# EAGLE design 9axis_Breakout (EAGLE 9.7.0)
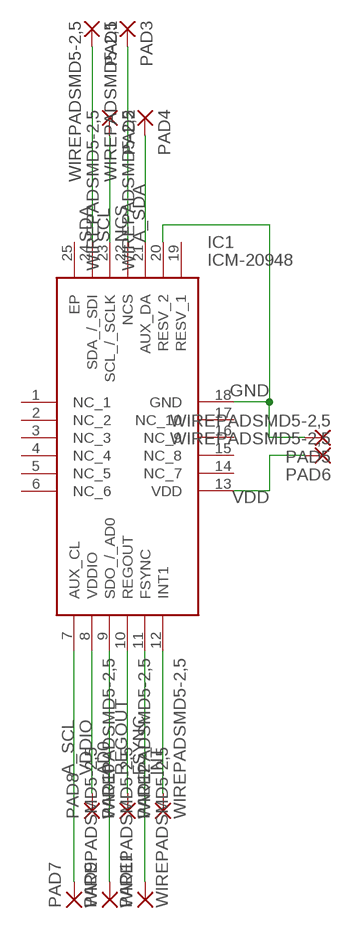
[diagram p0: schematic, sheet 1]

## Parts
IC1  ICM-20948  [QFN40P300X300X105-25N]
PAD1  WIREPADSMD5-2,5  [5-2,5]
PAD2  WIREPADSMD5-2,5  [5-2,5]
PAD3  WIREPADSMD5-2,5  [5-2,5]
PAD4  WIREPADSMD5-2,5  [5-2,5]
PAD5  WIREPADSMD5-2,5  [5-2,5]
PAD6  WIREPADSMD5-2,5  [5-2,5]
PAD7  WIREPADSMD5-2,5  [5-2,5]
PAD8  WIREPADSMD5-2,5  [5-2,5]
PAD9  WIREPADSMD5-2,5  [5-2,5]
PAD10  WIREPADSMD5-2,5  [5-2,5]
PAD11  WIREPADSMD5-2,5  [5-2,5]
PAD12  WIREPADSMD5-2,5  [5-2,5]

## Nets
A_SCL: IC1.7(AUX_CL) PAD7.1(P)
A_SDA: IC1.21(AUX_DA) PAD4.1(P)
AD0: IC1.9(SDO_/_AD0) PAD9.1(P)
FSYNC: IC1.11(FSYNC) PAD11.1(P)
GND: IC1.18(GND) IC1.20(RESV_2) PAD5.1(P)
INT: IC1.12(INT1) PAD12.1(P)
NCS: IC1.22(NCS) PAD3.1(P)
REGOUT: IC1.10(REGOUT) PAD10.1(P)
SCL: IC1.23(SCL_/_SCLK) PAD2.1(P)
SDA: IC1.24(SDA_/_SDI) PAD1.1(P)
VDD: IC1.13(VDD) PAD6.1(P)
VDDIO: IC1.8(VDDIO) PAD8.1(P)
Unconnected: IC1.1(NC_1) IC1.2(NC_2) IC1.3(NC_3) IC1.4(NC_4) IC1.5(NC_5) IC1.6(NC_6) IC1.14(NC_7) IC1.15(NC_8) IC1.16(NC_9) IC1.17(NC_10) IC1.19(RESV_1) IC1.25(EP)

## Library data of the parts
IC1 = ICM-20948:ICM-20948: IMUs - Inertial Measurement Units World's Lowest Power 9-Axis MEMS MotionTracking Device Source: Datasheet <https://product.tdk.com/system/files/dam/doc/product/sensor/mortion-inertial/imu/data_sheet/ds-000189-icm-20948-v1.3.pdf>; ARROW_PART_NUMBER: ICM-20948; ARROW_PRICE-STOCK: https://www.arrow.com/en/products/icm-20948/invensense?region=nac; DESCRIPTION: IMUs - Inertial Measurement Units World's Lowest Power 9-Axis MEMS MotionTracking Device; HEIGHT: 1.05mm; MANUFACTURER_NAME: TDK; MANUFACTURER_PART_NUMBER: ICM-20948; MOUSER_PART_NUMBER: 410-ICM-20948; MOUSER_PRICE-STOCK: https://www.mouser.co.uk/ProductDetail/TDK-InvenSense/ICM-20948?qs=u4fy%2FsgLU9OtGc31yF%2Friw%3D%3D
PAD1-PAD12 = wirepad:WIREPAD: Wire PAD connect wire on PCB

## Board
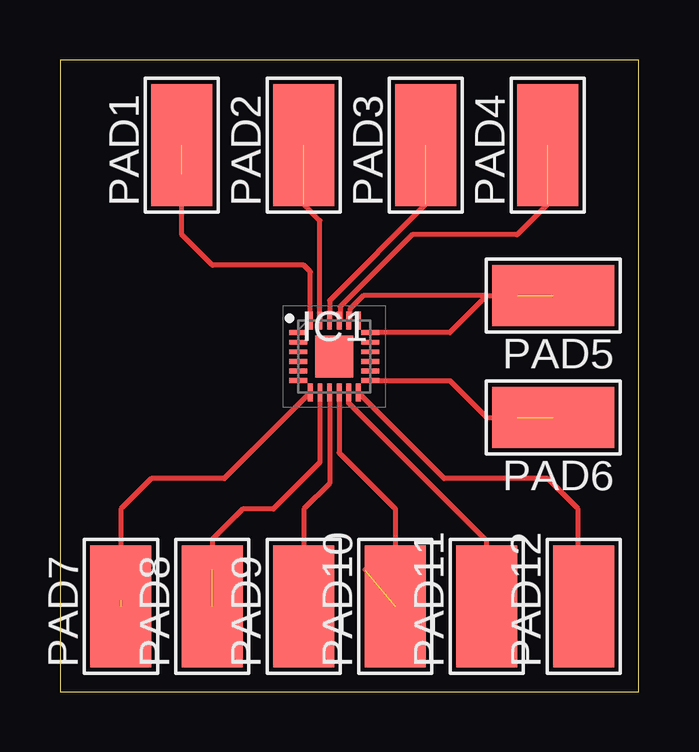
[diagram p1: board, top side]

Size 24.11 x 26.34 mm. Coordinates in mm from the lower left corner, seen from the top.
Outline: 0,0 24.11,0 24.11,26.34 0,26.34 0,0
Copper layers (1*16): Top / Bottom
Stack-up Default Layer Stack: Top User Defined 0.035mm / Dielectric-1 User Defined 1.5mm / Bottom User Defined 0.035mm
Design rules "default": minimum track width 6mil, minimum drill 0.35mm, track to track 6mil, track to pad 6mil, pad to pad 6mil, via to via 6mil, smd to smd 6mil, copper to edge 40mil, drill to drill 6mil, minimum pad ring 10mil, minimum via ring 8mil, stop-mask expansion 4mil, vias tented up to drill 0mil, thermal gap 10mil

### Footprints (pad centres in the part's own frame; a part is rotated, then mirrored left to right if it is on the bottom)
QFN40P300X300X105-25N = smd 0.75 x 0.2: 1 -1.5,1; 2 -1.5,0.6; 3 -1.5,0.2; 4 -1.5,-0.2; 5 -1.5,-0.6; 6 -1.5,-1; 13 1.5,-1; 14 1.5,-0.6; 15 1.5,-0.2; 16 1.5,0.2; 17 1.5,0.6; 18 1.5,1 | smd 0.2 x 0.75: 7 -1,-1.5; 8 -0.6,-1.5; 9 -0.2,-1.5; 10 0.2,-1.5; 11 0.6,-1.5; 12 1,-1.5; 19 1,1.5; 20 0.6,1.5; 21 0.2,1.5; 22 -0.2,1.5; 23 -0.6,1.5; 24 -1,1.5 | smd 1.59 x 1.75: 25 0,0
5-2,5 = smd 2.54 x 5.08: 1 0,0

### Placement (x,y rotation side)
IC1  11.43,13.97 0 top
PAD1  5.08,22.78 0 top
PAD2  10.16,22.78 0 top
PAD3  15.24,22.78 0 top
PAD4  20.32,22.78 0 top
PAD5  20.55,16.51 90 top
PAD6  20.55,11.43 90 top
PAD7  2.54,3.56 0 top
PAD8  6.35,3.56 0 top
PAD9  10.16,3.56 0 top
PAD10  13.97,3.56 0 top
PAD11  17.78,3.56 0 top
PAD12  21.82,3.56 0 top

### Tracks (layer width: path | path; a pad name or v marks a point on that pad's centre or on a via)
A_SCL  (1 unrouted)
  Top 0.203: IC1.7 6.85,8.89 3.81,8.89 2.54,7.62 2.54,3.81
A_SDA  (1 unrouted)
  Top 0.203: 20.32,20.32 19.05,19.05 14.67,19.05 11.67,16.05 11.67,15.51 IC1.21
AD0
  Top 0.203: IC1.9 11.23,8.69 10.16,7.62 PAD9.1
FSYNC
  Top 0.203: PAD11.1 17.78,6.29 12.03,12.04 IC1.11
GND  (1 unrouted)
  Top 0.203: IC1.18 16.24,14.97 17.78,16.51 | 17.78,16.51 19.05,16.51 | IC1.20 12.08,15.52 12.08,15.95 12.64,16.51 17.78,16.51
INT
  Top 0.203: PAD12.1 21.59,3.79 21.59,7.62 20.32,8.89 16.01,8.89 IC1.12
NCS  (1 unrouted)
  Top 0.203: IC1.22 11.23,16.31 15.24,20.32
REGOUT  (1 unrouted)
  Top 0.203: IC1.10 11.63,9.96 13.97,7.62 13.97,5.08 12.7,5.08
SCL  (1 unrouted)
  Top 0.203: IC1.23 10.83,19.65 10.16,20.32
SDA  (1 unrouted)
  Top 0.203: IC1.24 10.43,17.51 10.16,17.78 6.35,17.78 5.08,19.05 5.08,21.59
VDD  (1 unrouted)
  Top 0.203: IC1.13 16.24,12.97 17.78,11.43 19.05,11.43
VDDIO  (1 unrouted)
  Top 0.203: IC1.8 10.83,9.56 8.89,7.62 7.62,7.62 6.35,6.35 6.35,5.08